# EAGLE design MDM00001 (EAGLE 6.4)

## Sheet 1 of 2
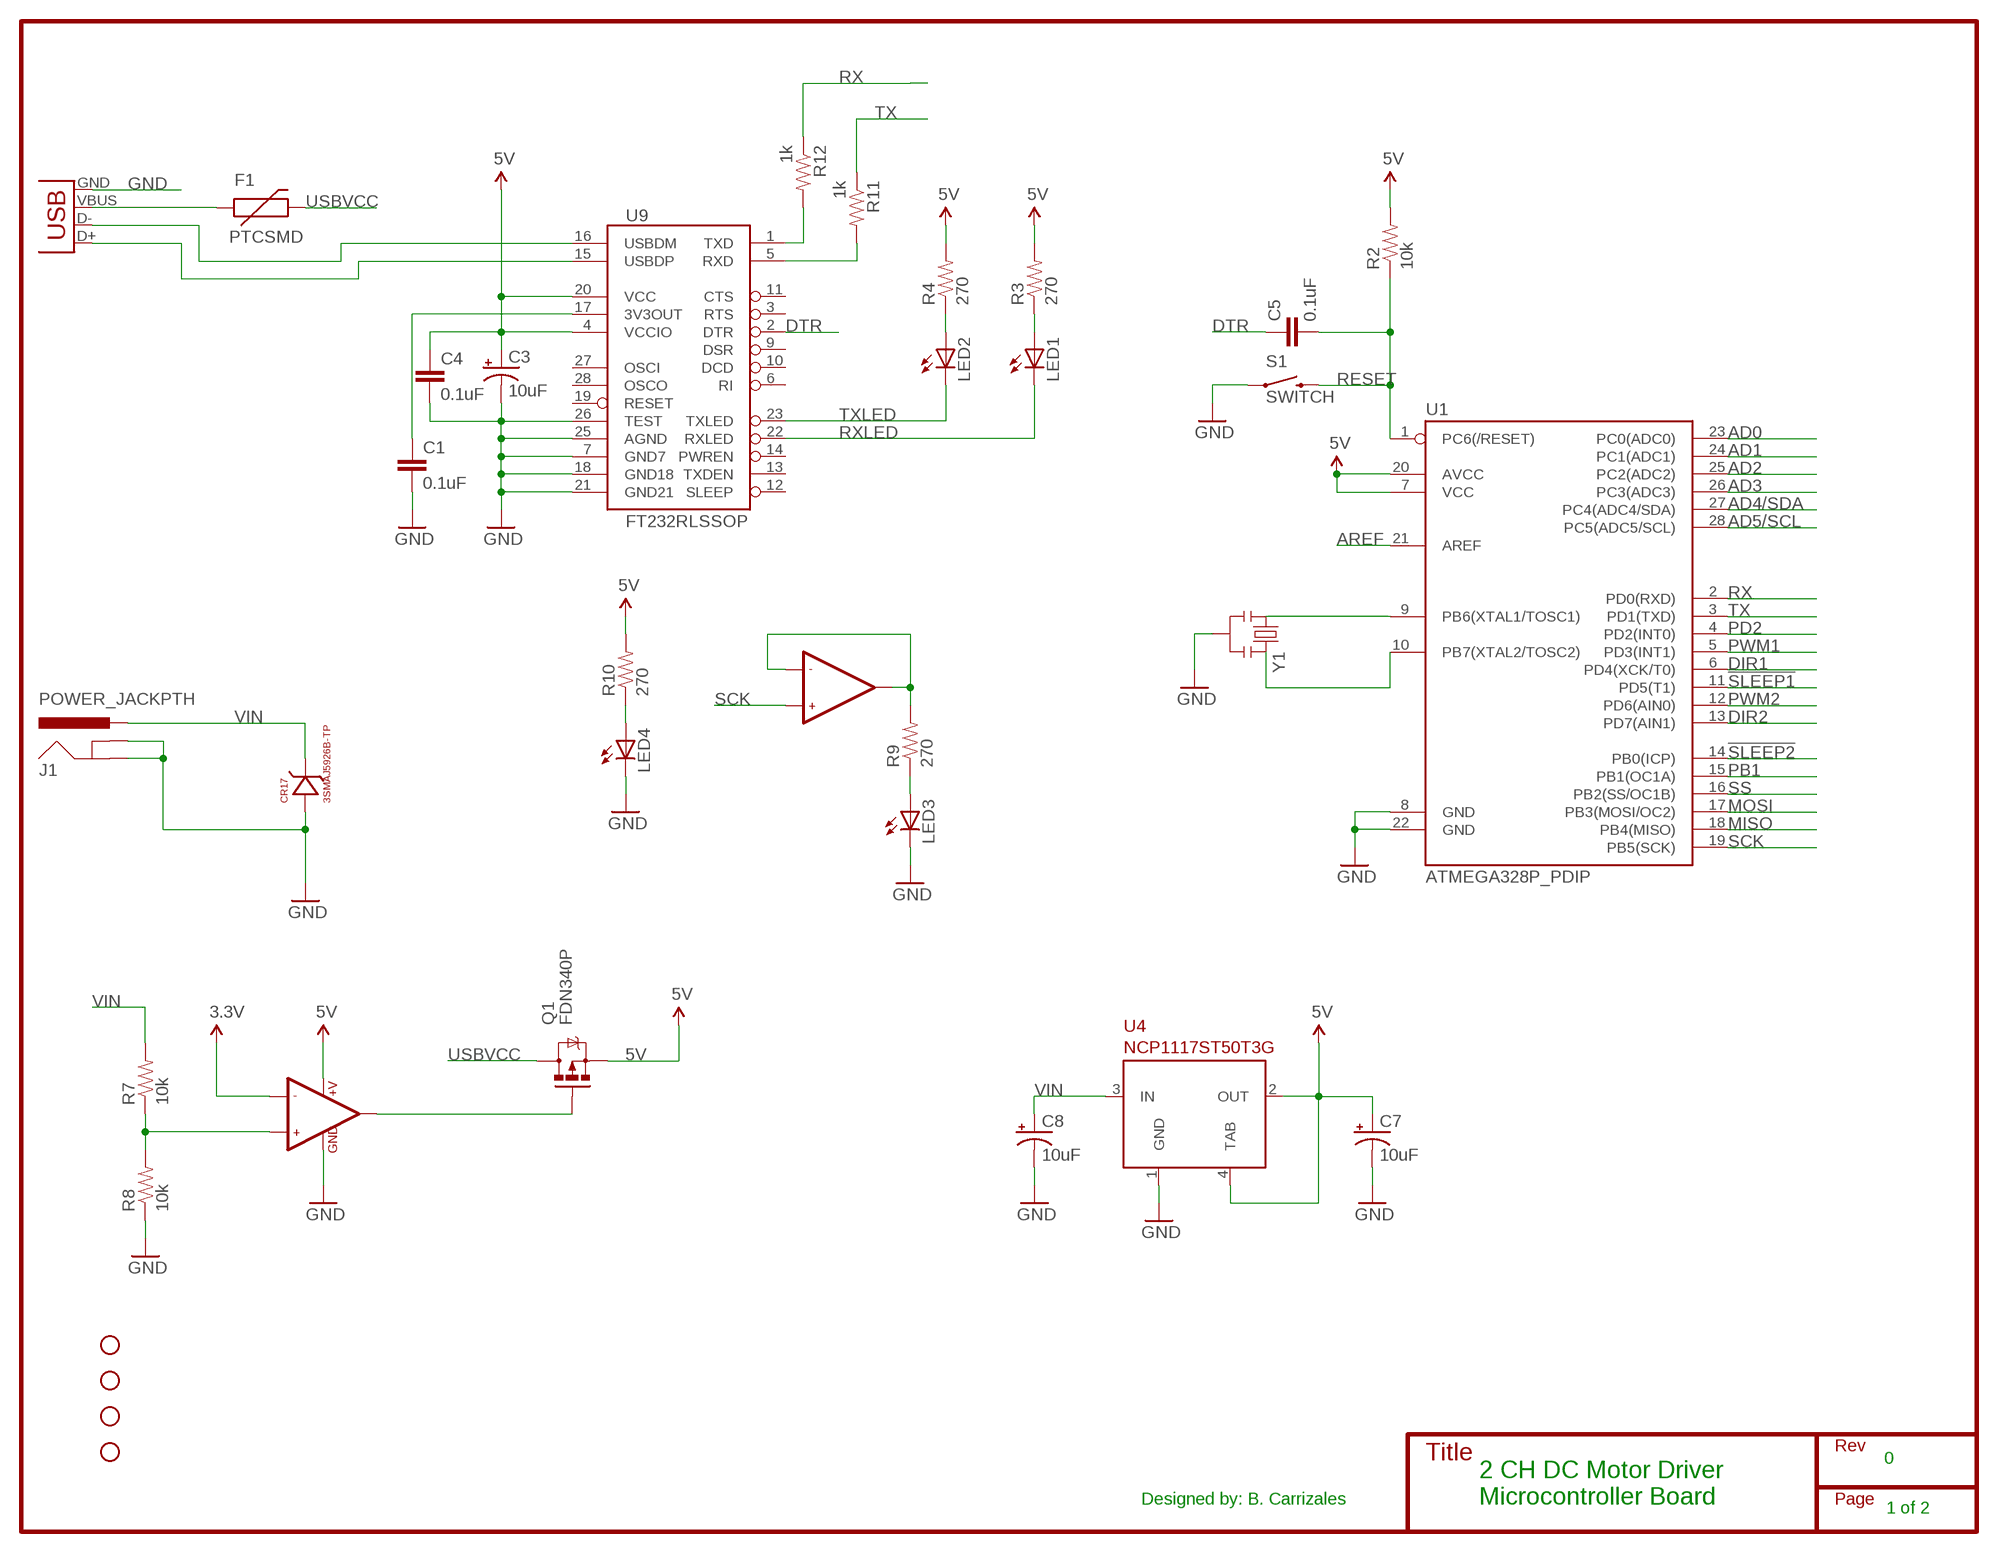
[diagram p0: schematic, sheet 1]

### Parts
C1  0.1uF  CAP0603-CAP  [0603-CAP]
C3  10uF  CAP_POL_AL  [PANASONIC_BMIN]
C4  0.1uF  CAP0603-CAP  [0603-CAP]
C5  0.1uF  CAP0603-CAP  [0603-CAP]
C7  10uF  CAP_POL_AL  [PANASONIC_BMIN]
C8  10uF  CAP_POL_AL  [PANASONIC_BMIN]
CR17  3SMAJ5926B-TP  [DO-214AC]
F1  PTCSMD  [PTC-1206]
J1  POWER_JACKPTH  [POWER_JACK_PTH]
JP2  USBSMD  [USB-MINIB]
LED1  LED0603  [LED-0603]
LED2  LED0603  [LED-0603]
LED3  LED0603  [LED-0603]
LED4  LED0603  [LED-0603]
Q1  FDN340P  MOSFET-PCHANNELSMD  [SOT23-3]
R2  10k  RESISTOR0603-RES  [0603-RES]
R3  270  RESISTOR0603-RES  [0603-RES]
R4  270  RESISTOR0603-RES  [0603-RES]
R7  10k  RESISTOR0603-RES  [0603-RES]
R8  10k  RESISTOR0603-RES  [0603-RES]
R9  270  RESISTOR0603-RES  [0603-RES]
R10  270  RESISTOR0603-RES  [0603-RES]
R11  1k  RESISTOR0603-RES  [0603-RES]
R12  1k  RESISTOR0603-RES  [0603-RES]
S1  SWITCH  SWITCH-MOMENTARY-2PTH  [TACTILE-PTH]
STANDOFF1  STAND-OFF  [STAND-OFF]
STANDOFF2  STAND-OFF  [STAND-OFF]
STANDOFF3  STAND-OFF  [STAND-OFF]
STANDOFF4  STAND-OFF  [STAND-OFF]
U1  ATMEGA328P_PDIP  [DIL28-3]
U4  NCP1117ST50T3G  [SOT223]
U9  FT232RLSSOP  [SSOP28DB]
U$3  LMV358  [SO08]
Y1  RESONATORPTH  [RESONATOR-PTH]

### Nets
3.3V: U$3.2(-IN1)
5V: C3.+ C4.1 C7.+ Q1.2(S) R2.2 R3.2 R4.2 R10.2 U1.7(VCC) U1.20(AVCC) U4.2(OUT) U4.4(TAB) U9.4(VCCIO) U9.20(VCC) U$3.8(+V) ; also sheet 2
!SLEEP1: U1.11(PD5(T1)) ; also sheet 2
!SLEEP2: U1.14(PB0(ICP)) ; also sheet 2
AD0: U1.23(PC0(ADC0)) ; also sheet 2
AD1: U1.24(PC1(ADC1)) ; also sheet 2
AD2: U1.25(PC2(ADC2)) ; also sheet 2
AD3: U1.26(PC3(ADC3))
AD4/SDA: U1.27(PC4(ADC4/SDA))
AD5/SCL: U1.28(PC5(ADC5/SCL))
AREF: U1.21(AREF)
DIR1: U1.6(PD4(XCK/T0)) ; also sheet 2
DIR2: U1.13(PD7(AIN1)) ; also sheet 2
DTR: C5.1 U9.2(DTR)
GND: C1.2 C3.- C4.2 C7.- C8.- CR17.AN J1.GND J1.GNDBREAK JP2.GND LED3.C LED4.C R8.1 S1.1 U1.8(GND) U1.22(GND) U4.1(GND) U9.7(GND7) U9.18(GND18) U9.21(GND21) U9.25(AGND) U9.26(TEST) U$3.4(GND) Y1.2 ; also sheet 2
MISO: U1.18(PB4(MISO)) ; also sheet 2
MOSI: U1.17(PB3(MOSI/OC2)) ; also sheet 2
N$1: U1.9(PB6(XTAL1/TOSC1)) Y1.1
N$2: U1.10(PB7(XTAL2/TOSC2)) Y1.3
N$4: JP2.D- U9.16(USBDM)
N$5: JP2.D+ U9.15(USBDP)
N$6: F1.1 JP2.VBUS
N$7: LED2.A R4.1
N$8: LED1.A R3.1
N$9: R12.2 U9.1(TXD)
N$10: R11.2 U9.5(RXD)
N$12: R7.1 R8.2 U$3.3(+IN1)
N$13: LED3.A R9.1
N$15: R9.2 U$3.6(-IN2) U$3.7(OUT2)
N$17: Q1.1(G) U$3.1(OUT1)
N$19: LED4.A R10.1
N$20: C1.1 U9.17(3V3OUT)
PB1: U1.15(PB1(OC1A))
PD2: U1.4(PD2(INT0))
PWM1: U1.5(PD3(INT1)) ; also sheet 2
PWM2: U1.12(PD6(AIN0)) ; also sheet 2
RESET: C5.2 R2.1 S1.3 U1.1(PC6(/RESET)) ; also sheet 2
RX: R12.1 U1.2(PD0(RXD))
RXLED: LED1.C U9.22(RXLED)
SCK: U1.19(PB5(SCK)) U$3.5(+IN2) ; also sheet 2
SS: U1.16(PB2(SS/OC1B))
TX: R11.1 U1.3(PD1(TXD))
TXLED: LED2.C U9.23(TXLED)
USBVCC: F1.2 Q1.3(D)
VIN: C8.+ CR17.CAT J1.PWR R7.2 U4.3(IN) ; also sheet 2
Unconnected: U9.3(RTS) U9.6(RI) U9.9(DSR) U9.10(DCD) U9.11(CTS) U9.12(SLEEP) U9.13(TXDEN) U9.14(PWREN) U9.19(RESET) U9.27(OSCI) U9.28(OSCO)

### Notes on the sheet
- 0
- Designed by: B. Carrizales
- 2 CH DC Motor Driver
  Microcontroller Board
- 1 of 2

## Sheet 2 of 2
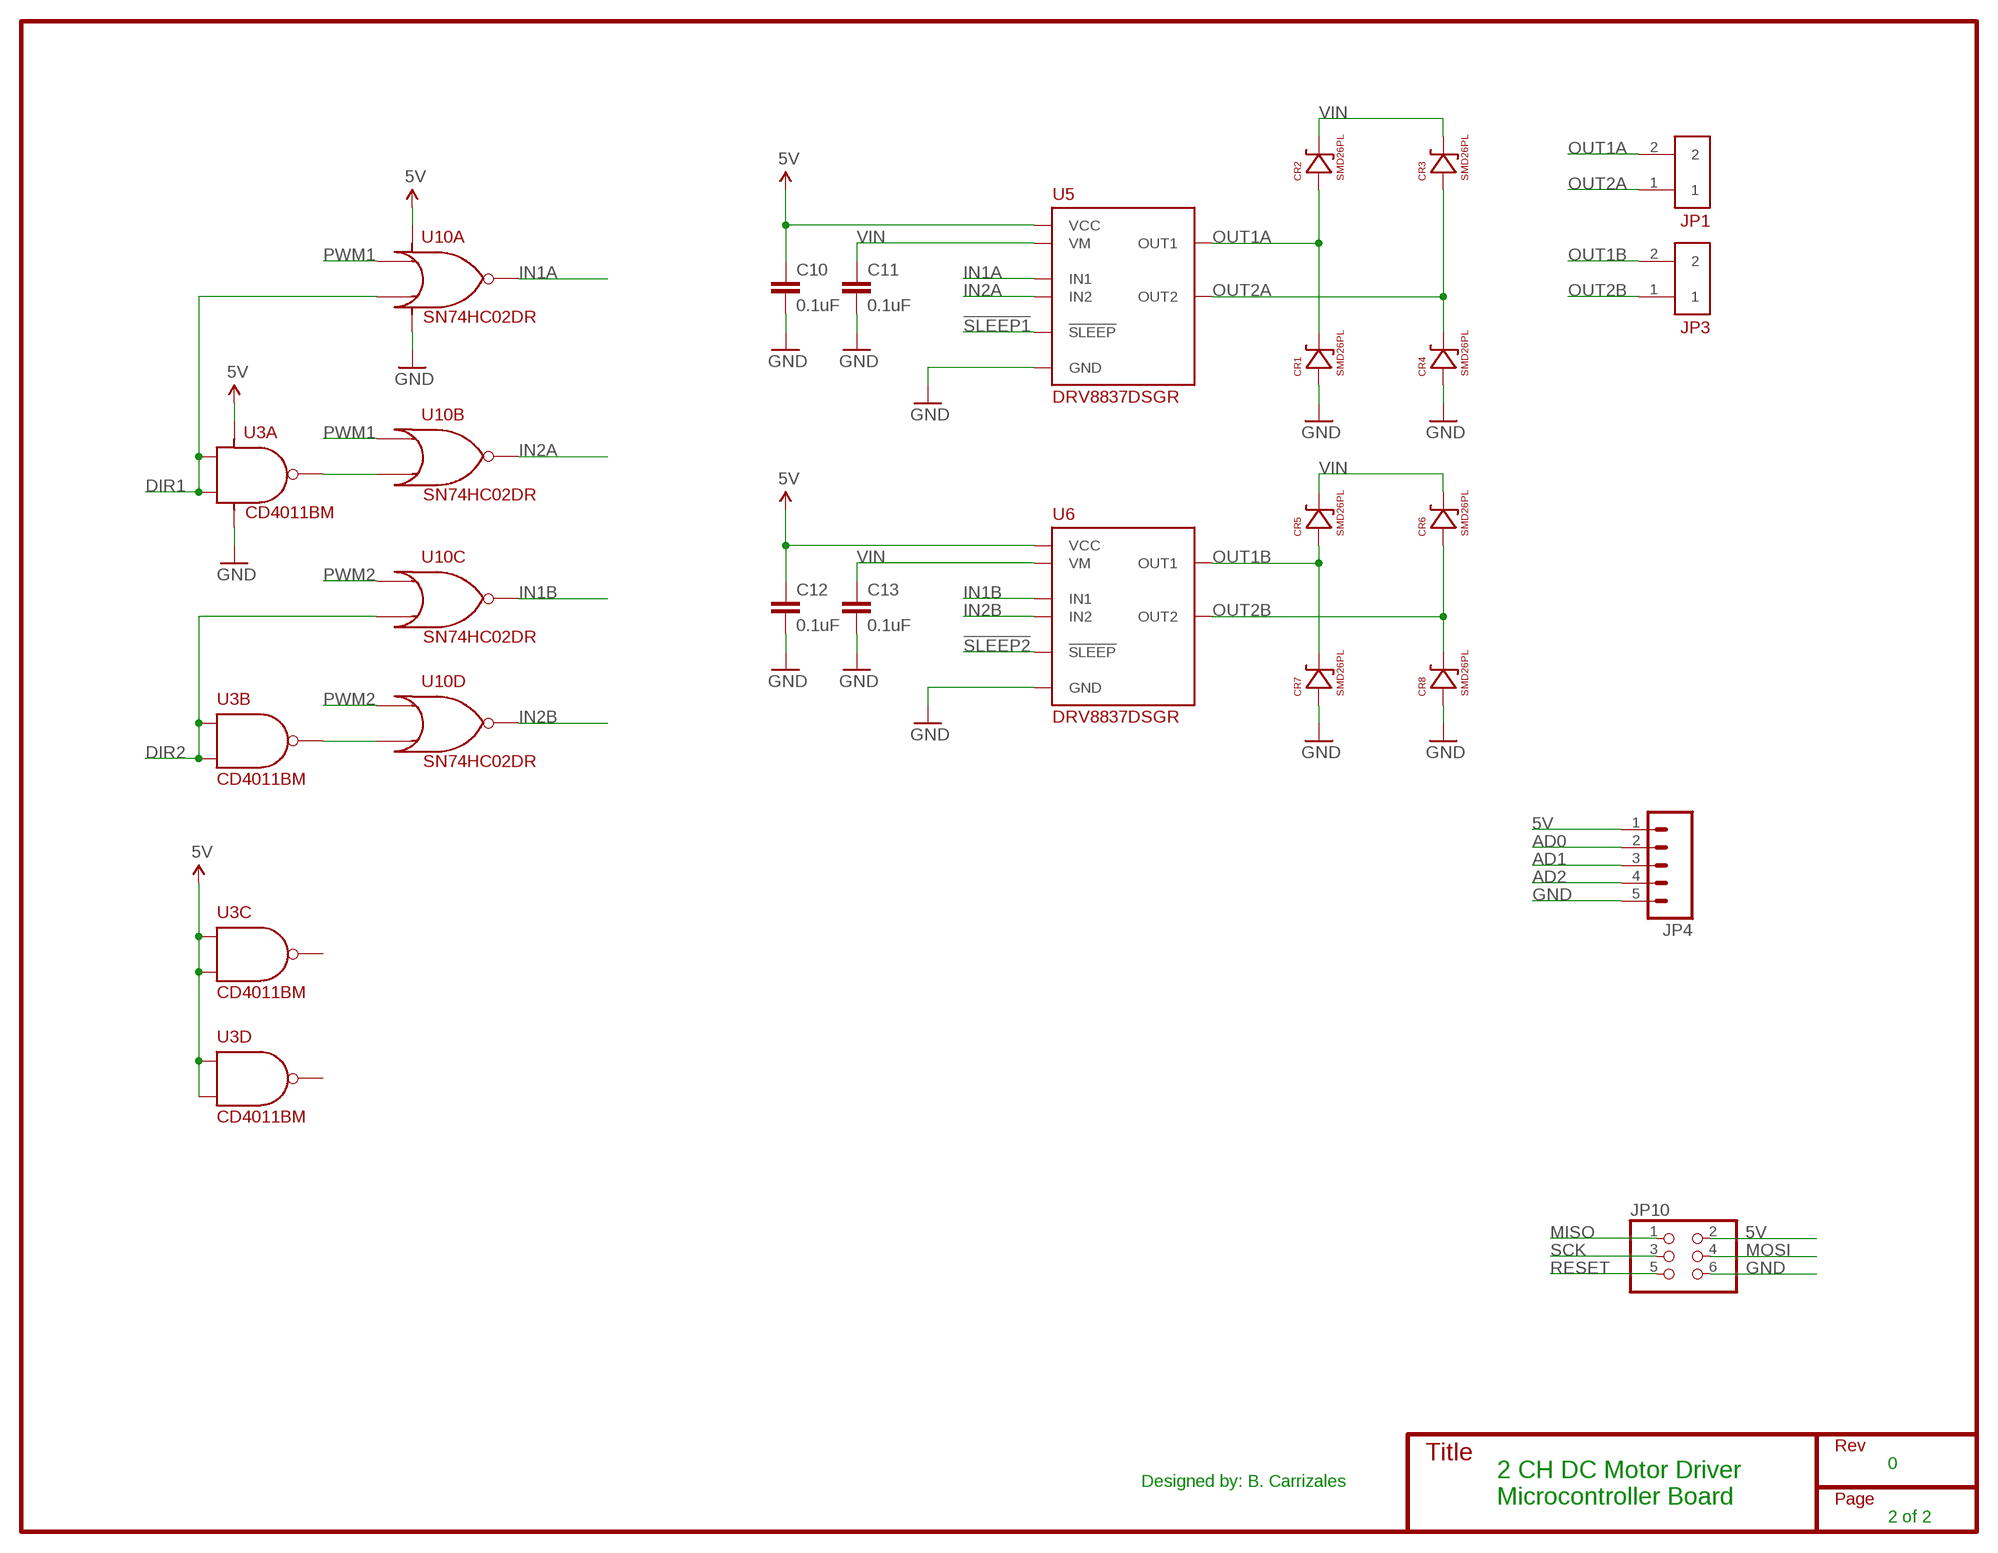
[diagram p1: schematic, sheet 2]

### Parts
C10  0.1uF  CAP0603-CAP  [0603-CAP]
C11  0.1uF  CAP0603-CAP  [0603-CAP]
C12  0.1uF  CAP0603-CAP  [0603-CAP]
C13  0.1uF  CAP0603-CAP  [0603-CAP]
CR1  SMD26PL  [SOD-123FL]
CR2  SMD26PL  [SOD-123FL]
CR3  SMD26PL  [SOD-123FL]
CR4  SMD26PL  [SOD-123FL]
CR5  SMD26PL  [SOD-123FL]
CR6  SMD26PL  [SOD-123FL]
CR7  SMD26PL  [SOD-123FL]
CR8  SMD26PL  [SOD-123FL]
JP1  2-TERMINAL  [OSTTA020161]
JP3  2-TERMINAL  [OSTTA020161]
JP4  M05PTH  [1X05]
JP10  PINHD-2X3  [2X03]
U3  CD4011BM  [14-SOIC]
U5  DRV8837DSGR  [8-WSON]
U6  DRV8837DSGR  [8-WSON]
U10  SN74HC02DR  [14-SOIC]

### Nets
5V: C10.1 C12.1 JP4.1 JP10.2 U3.8(C:I0) U3.9(C:I1) U3.12(D:I0) U3.13(D:I1) U3.14 U5.P$8(VCC) U6.P$8(VCC) U10.14 ; also sheet 1
!SLEEP1: U5.P$7(!SLEEP) ; also sheet 1
!SLEEP2: U6.P$7(!SLEEP) ; also sheet 1
AD0: JP4.2 ; also sheet 1
AD1: JP4.3 ; also sheet 1
AD2: JP4.4 ; also sheet 1
DIR1: U3.1(A:I0) U3.2(A:I1) U10.3(A:I1) ; also sheet 1
DIR2: U3.5(B:I0) U3.6(B:I1) U10.9(C:I1) ; also sheet 1
GND: C10.2 C11.2 C12.2 C13.2 CR1.1 CR4.1 CR7.1 CR8.1 JP4.5 JP10.6 U3.7 U5.P$4(GND) U6.P$4(GND) U10.7 ; also sheet 1
IN1A: U5.P$6(IN1) U10.1(A:O1)
IN1B: U6.P$6(IN1) U10.10(C:O1)
IN2A: U5.P$5(IN2) U10.4(B:O1)
IN2B: U6.P$5(IN2) U10.13(D:O1)
MISO: JP10.1 ; also sheet 1
MOSI: JP10.4 ; also sheet 1
N$3: U3.4(B:O1) U10.12(D:I1)
N$27: U3.3(A:O1) U10.6(B:I1)
OUT1A: CR1.2 CR2.1 JP1.2 U5.P$2(OUT1)
OUT1B: CR5.1 CR7.2 JP3.2 U6.P$2(OUT1)
OUT2A: CR3.1 CR4.2 JP1.1 U5.P$3(OUT2)
OUT2B: CR6.1 CR8.2 JP3.1 U6.P$3(OUT2)
PWM1: U10.2(A:I0) U10.5(B:I0) ; also sheet 1
PWM2: U10.8(C:I0) U10.11(D:I0) ; also sheet 1
RESET: JP10.5 ; also sheet 1
SCK: JP10.3 ; also sheet 1
VIN: C11.1 C13.1 CR2.2 CR3.2 CR5.2 CR6.2 U5.P$1(VM) U6.P$1(VM) ; also sheet 1
Unconnected: U3.10(C:O1) U3.11(D:O1)

### Notes on the sheet
- 0
- Designed by: B. Carrizales
- 2 CH DC Motor Driver
  Microcontroller Board
- 2 of 2

## Library data of the parts
C1 C4 C5 C10-C13 = SparkFun-Passives:CAP: Capacitor Standard 0603 ceramic capacitor, and 0.1" leaded capacitor.
C3 C7 C8 = Passives:CAP_POL_AL: Panasonic Aluminum Electrolytic Capacitor Package B
CR1-CR8 = DiscreteActive:SMD26PL: Schottky Barrier Diode SMD26PL; DIGIKEYPART#: SMD26PL-TPMSCT-ND
CR17 = DiscreteActive:3SMAJ5926B-TP: 3SMAJ5926B-TP, 3W SMD Zener Diode, 11V Regulator; DIGIKEYPART#: 3SMAJ5926B-TPMSCT-ND
F1 = SparkFun-PowerIC:PTC: Resettable Fuse PTC Resettable Fuse. Spark Fun Electronics SKU : COM-08357
J1 = SparkFun-Connectors:POWER_JACK: Power Jack This is the standard 5.5mm barrel jack for power. The PTH is the most common, proven, reliable, footprint. The Slot footprint only works if the mill layer is transmitted to the PCB fab house so be warned. Spark Fun Electronics SKU : PRT-00119 SMT: CONN-08106 Mating wall wart : TOL-00298 (and others)
JP1 JP3 = Connectors:2-TERMINAL: 2-Terminal Header. Based on OSTTA020161; DIGIKEYPART#: ED2561-ND; PART#: OSTTA020161
JP2 = SparkFun-Connectors:USB: USB Connectors USB-B-PTH is fully proven SKU : PRT-00139/CONN-08278 USB-miniB is fully proven SKU : PRT-00587 USB-A-PCB is untested. USB-A-H is throughly reviewed, but untested. Spark Fun Electronics SKU : PRT-00437 USB-B-SMT is throughly reviewed, but untested. Needs silkscreen touching up. USB-A-S has not been used/tested USB-MB-H has not been used/tested USB-MICROB has been used. CONN-09505
JP4 = SparkFun-Connectors:M05: Header 5 Standard 5-pin 0.1" header. Use with straight break away headers (SKU : PRT-00116), right angle break away headers (PRT-00553), swiss pins (PRT-00743), machine pins (PRT-00117), and female headers (PRT-00115). Molex polarized connector foot print use with SKU : PRT-08230 with associated crimp pins and housings.
JP10 = SparkFun-Connectors:PINHD-2X3: PIN HEADER
LED1-LED4 = SparkFun-LED:LED: LEDs Standard schematic elements and footprints for 5mm, 3mm, 1206, and 0603 sized LEDs. 5mm - Spark Fun Electronics SKU : COM-00529 (and others)
Q1 = SparkFun-DiscreteSemi:MOSFET-PCHANNEL: Generic PMOSFET
R2-R4 R7-R12 = SparkFun-Passives:RESISTOR: Resistor Basic schematic elements and footprints for 0603, 1206, and PTH resistors.
S1 = SparkFun-Electromechanical:SWITCH-MOMENTARY-2: Various NO switches- pushbuttons, reed, etc
STANDOFF1-STANDOFF4 = SparkFun-Electromechanical:STAND-OFF: #4 Stand Off This is the mechanical footprint for a #4 phillips button head screw. Use the keepout ring to avoid running the screw head into surrounding components. SKU : PRT-00447
U1 = SparkFun-DigitalIC:ATMEGA328P_PDIP: uC used in the Arduino 32kb flash, 1k EEPROM, 2k SRAM This is the through-hole version of this chip.
U3 = LogicICs:CD4011: CD4011 Quad NAND gate discrete logic IC; DIGIKEYPART#: 296-14474-1-ND
U4 = regulators:NCP1117ST50T3G: NCP1117 5V, 1.0 A Low-Dropout Positive Fixed and Adjustable Voltage Regulator Datasheet <http://www.onsemi.com/pub_link/Collateral/NCP1117-D.PDF>; DIGIKEYPART#: NCP1117ST50T3GOSCT-ND
U5 U6 = PowerICs:DRV8837DSGR: DRV8837DSGR, DC Motor Driver IC see datasheet for more information datasheet <http://www.ti.com/lit/ds/symlink/drv8837.pdf>; DIGIKEYPART#: 296-34806-1-ND
U9 = SparkFun-DigitalIC:FT232RL: USB UART FT232RL 4th Generation USB UART (USB <-> Serial) Controller. Spark Fun Electronics SKU : COM-00650 Production SKU IC-00870; PROD_ID: IC-00870
U10 = LogicICs:SN74HC02DR: SN74HC02DR, Quad, Dual Input Nor Gate; DIGIKEYPART#: 296-1188-1-ND
U$3 = SparkFun-AnalogIC:LMV358: Jellybean rail-to-rail output op-amp; PROD_ID: IC-09657
Y1 = SparkFun-FreqCtrl:RESONATOR: Resonator Small SMD resonator. Used, eg, on the Arduino Pro/ Pro Mini boards. 8MHz- XTAL-08895 16MHz- XTAL-08900

## Board
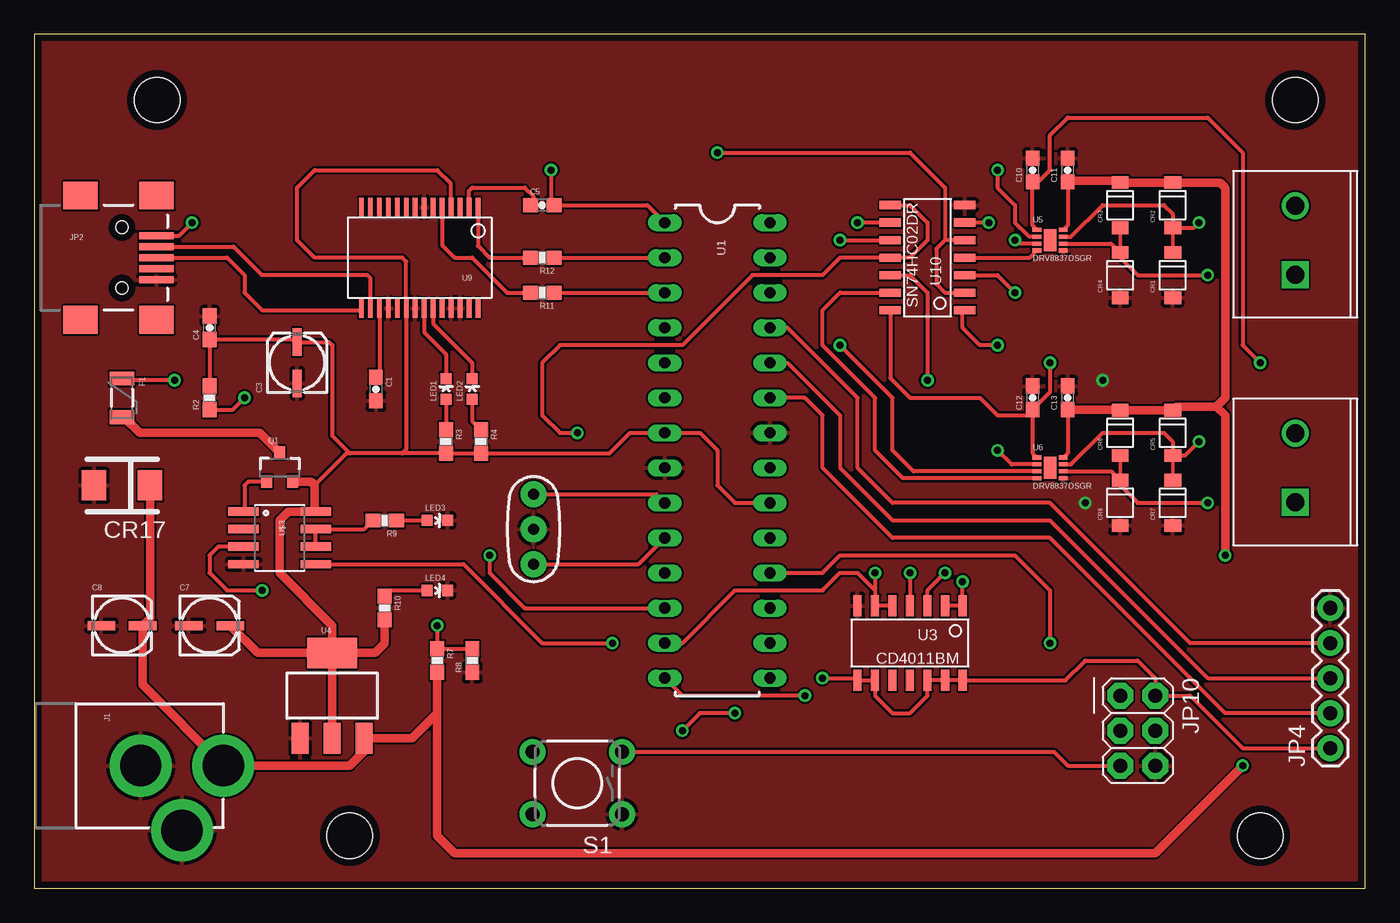
[diagram p2: board, top side]
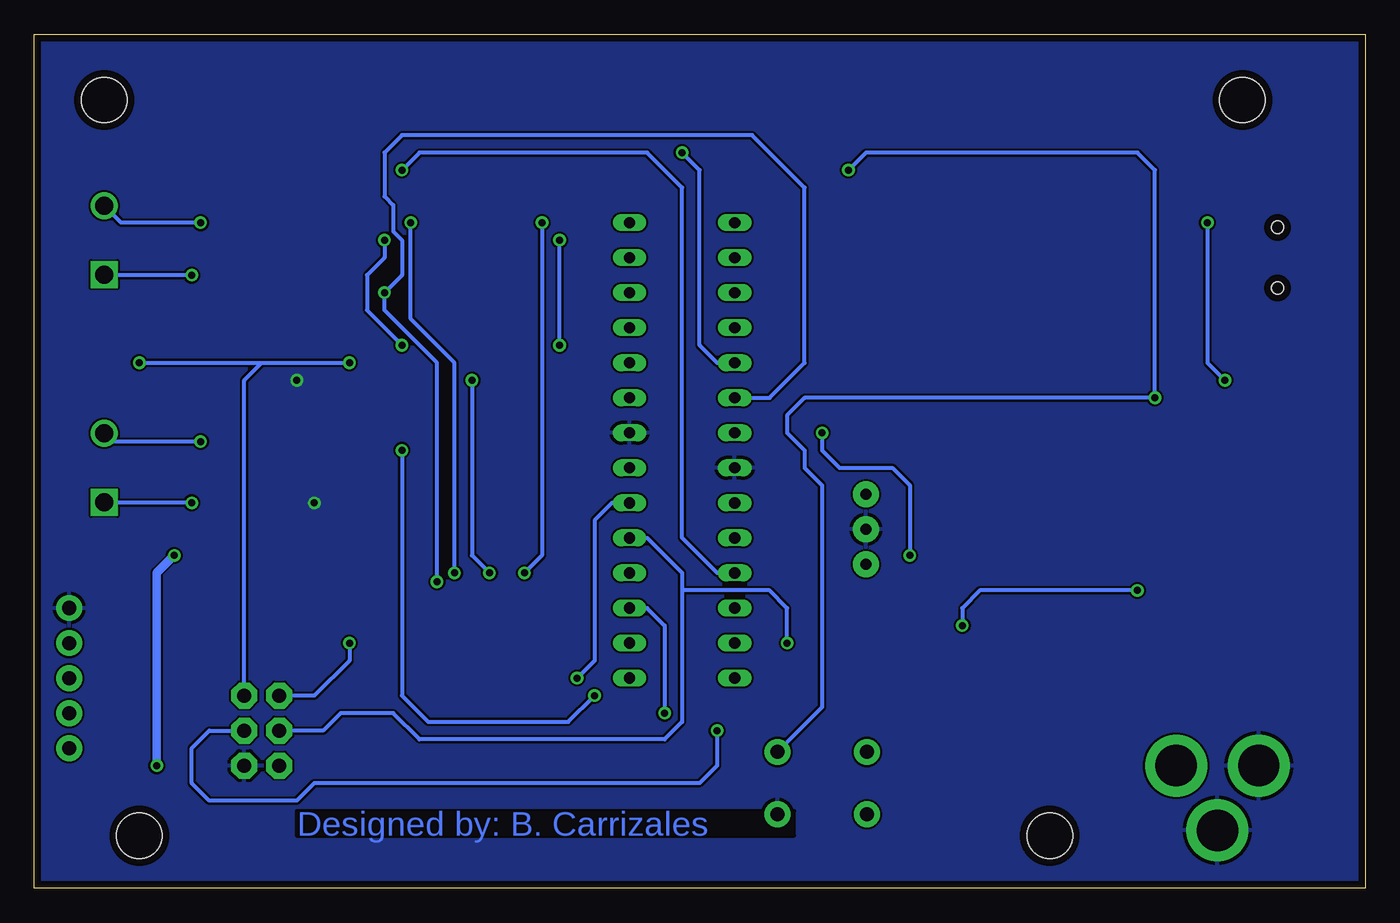
[diagram p3: board, bottom side, seen from below]

Size 96.5 x 61.9 mm. Coordinates in mm from the lower left corner, seen from the top.
Outline: 0,0 96.5,0 96.5,61.9 0,61.9 0,0
Copper layers (1*16): Top 0.0178mm / dielectric 59mil / Bottom 0.0178mm
Design rules "SSC-EAGLE-2Lyr_v1.0.0.3": minimum track width 6mil, minimum drill 14mil, track to track 6mil, track to pad 6mil, pad to pad 6mil, via to via 6mil, smd to smd 6mil, copper to edge 20mil, drill to drill 16mil, minimum pad ring 8mil, minimum via ring 8mil, stop-mask expansion 3mil, vias tented up to drill 0mil, thermal gap 10mil

### Footprints (pad centres in the part's own frame; a part is rotated, then mirrored left to right if it is on the bottom)
0603-CAP = smd 1.1 x 1: 1 -0.85,0; 2 0.85,0
PANASONIC_BMIN = smd 2 x 0.65: + 1.5,0; - -1.5,0
SOD-123FL = smd 0.914 x 1.219: 1 -1.638,0; 2 1.638,0
DO-214AC = smd 1.778 x 2.159: AN 2.032,0; CAT -2.032,0
PTC-1206 = smd 1 x 1.8: 1 -1.4,0; 2 1.4,0
POWER_JACK_PTH = drill 2.997 pad 4.318: GND 0,7.7; GNDBREAK 4.7,10.7; PWR 0,13.7
OSTTA020161 = drill 1.3 square: 1 -2.5,0 | drill 1.3: 2 2.5,0
USB-MINIB = smd 2.5 x 0.5: D+ 2.5,0; D- 2.5,0.8; GND 2.5,-1.6; ID 2.5,-0.8; VBUS 2.5,1.6 | smd 2.5 x 2: MTN1 -3,4.5; MTN2 2.5,4.5; MTN3 -3,-4.5; MTN4 2.5,-4.5 | hole 0.9: 0,2.2; 0,-2.2
1X05 = drill 1.016 pad 1.88: 1 0,0; 2 2.54,0; 3 5.08,0; 4 7.62,0; 5 10.16,0
2X03 = drill 1.016 pad 1.88 octagon: 1 -2.54,-1.27; 2 -2.54,1.27; 3 0,-1.27; 4 0,1.27; 5 2.54,-1.27; 6 2.54,1.27
LED-0603 = smd 0.8 x 0.8: A 0,-0.75; C 0,0.75
SOT23-3 = smd 0.8 x 0.9: 1 -0.95,-1; 2 0.95,-1; 3 0,1.1
0603-RES = smd 1.1 x 1: 1 -0.85,0; 2 0.85,0
TACTILE-PTH = drill 1.016 pad 1.88: 1 -3.251,2.261; 2 3.251,2.261; 3 -3.251,-2.261; 4 3.251,-2.261
STAND-OFF = hole 3.302: 0,0
DIL28-3 = drill 0.813 long: 1 -16.51,-3.81; 2 -13.97,-3.81; 3 -11.43,-3.81; 4 -8.89,-3.81; 5 -6.35,-3.81; 6 -3.81,-3.81; 7 -1.27,-3.81; 8 1.27,-3.81; 9 3.81,-3.81; 10 6.35,-3.81; 11 8.89,-3.81; 12 11.43,-3.81; 13 13.97,-3.81; 14 16.51,-3.81; 15 16.51,3.81; 16 13.97,3.81; 17 11.43,3.81; 18 8.89,3.81; 19 6.35,3.81; 20 3.81,3.81; 21 1.27,3.81; 22 -1.27,3.81; 23 -3.81,3.81; 24 -6.35,3.81; 25 -8.89,3.81; 26 -11.43,3.81; 27 -13.97,3.81; 28 -16.51,3.81
14-SOIC = smd 0.6 x 1.55: 1 -3.81,-2.7; 2 -2.54,-2.7; 3 -1.27,-2.7; 4 0,-2.7; 5 1.27,-2.7; 6 2.54,-2.7; 7 3.81,-2.7; 8 3.81,2.7; 9 2.54,2.7; 10 1.27,2.7; 11 0,2.7; 12 -1.27,2.7; 13 -2.54,2.7; 14 -3.81,2.7
SOT223 = smd 1.219 x 2.235: 1 -2.311,-3.099; 2 0,-3.099; 3 2.311,-3.099 | smd 3.6 x 2.2: 4 0,3.099
8-WSON = smd 0.3 x 0.64: P$1 -0.75,0.95; P$2 -0.25,0.95; P$3 0.25,0.95; P$4 0.75,0.95; P$5 0.75,-0.95; P$6 0.25,-0.95; P$7 -0.25,-0.95; P$8 -0.75,-0.95 | smd 1.6 x 0.9: P$9 0,0
SSOP28DB = smd 0.348 x 1.397: 1 -4.225,-3.656; 2 -3.575,-3.656; 3 -2.925,-3.656; 4 -2.275,-3.656; 5 -1.625,-3.656; 6 -0.975,-3.656; 7 -0.325,-3.656; 8 0.325,-3.656; 9 0.975,-3.656; 10 1.625,-3.656; 11 2.275,-3.656; 12 2.925,-3.656; 13 3.575,-3.656; 14 4.225,-3.656; 15 4.225,3.656; 16 3.575,3.656; 17 2.925,3.656; 18 2.275,3.656; 19 1.625,3.656; 20 0.975,3.656; 21 0.325,3.656; 22 -0.325,3.656; 23 -0.975,3.656; 24 -1.625,3.656; 25 -2.275,3.656; 26 -2.925,3.656; 27 -3.575,3.656; 28 -4.225,3.656
SO08 = smd 0.61 x 2.21: 1 -1.905,-2.616; 2 -0.635,-2.616; 3 0.635,-2.616; 4 1.905,-2.616; 5 1.905,2.616; 6 0.635,2.616; 7 -0.635,2.616; 8 -1.905,2.616
RESONATOR-PTH = drill 0.8 pad 1.88: 1 -2.54,0; 2 0,0; 3 2.54,0

### Placement (x,y rotation side)
C1  24.77,36.2 270 top
C3  19.05,38.1 90 top
C4  12.7,40.64 90 top
C5  36.83,49.53 0 top
C7  12.7,19.05 0 top
C8  6.35,19.05 0 top
C10  72.39,52.07 90 top
C11  74.93,52.07 90 top
C12  72.39,35.56 90 top
C13  74.93,35.56 90 top
CR1  82.55,44.45 90 top
CR2  82.55,49.53 90 top
CR3  78.74,49.53 90 top
CR4  78.74,44.45 90 top
CR5  82.55,33.02 90 top
CR6  78.74,33.02 90 top
CR7  82.55,27.94 90 top
CR8  78.74,27.94 90 top
CR17  6.35,29.21 180 top
F1  6.35,35.56 270 top
J1  0,8.89 270 top
JP1  91.44,46.99 90 top
JP2  6.35,45.72 0 top
JP3  91.44,30.48 90 top
JP4  93.98,10.16 90 top
JP10  80.01,11.43 270 top
LED1  29.84,36.2 0 top
LED2  31.75,36.2 0 top
LED3  29.21,26.67 270 top
LED4  29.21,21.59 270 top
Q1  17.78,30.48 0 top
R2  12.7,35.56 90 top
R3  29.84,32.38 270 top
R4  32.38,32.38 270 top
R7  29.21,16.51 270 top
R8  31.75,16.51 90 top
R9  25.4,26.67 180 top
R10  25.4,20.32 270 top
R11  36.83,43.18 180 top
R12  36.83,45.72 180 top
S1  39.37,7.62 180 top
STANDOFF1  91.44,57.15 0 top
STANDOFF2  22.86,3.81 0 top
STANDOFF3  8.89,57.15 0 top
STANDOFF4  88.9,3.81 0 top
U1  49.53,31.75 270 top
U3  63.5,17.78 180 top
U4  21.59,13.97 0 top
U5  73.66,46.99 270 top
U6  73.66,30.48 270 top
U9  27.94,45.72 180 top
U10  64.77,45.72 90 top
U$3  17.78,25.4 270 top
Y1  36.2,26.04 270 top

### Tracks (layer width: path | path; a pad name or v marks a point on that pad's centre or on a via)
5V  (via drill 0.51)
  Top 0.305: C10.1 72.39,50.8 | U5.P$8 72.39,48.06 72.39,50.8 | C12.1 72.39,31.55 U6.P$8 | U9.4 30.21,51.06 29.21,52.07 20.32,52.07 19.05,50.8 19.05,46.99 20.32,45.72 26.67,45.72 26.96,45.42 U9.20 26.96,31.83 26.67,31.54 | R2.2 C4.1 18.86,39.79 C3.+ 21.36,39.6 21.59,39.37 21.59,32.8 22.86,31.54 | 26.67,31.54 R3.2 R4.2 41.7,31.54 43.18,33.02 U1.7 48.26,33.02 49.53,31.75 49.53,29.21 50.8,27.94 U1.20 | 26.67,31.54 22.86,31.54 | 22.86,31.54 22.64,31.54 20.32,29.21 | JP4.1 87.63,10.16 83.82,13.97 JP10.2 81.28,15.24 80.01,16.51 76.2,16.51 74.77,15.08 U3.14 U3.13 U3.12 64.77,13.97 63.5,12.7 62.23,12.7 60.96,13.97 U3.9 U3.8 59.53,15.24 v57.15,15.24 | 72.39,50.8 73.66,52.07 73.66,54.61 74.93,55.88 85.09,55.88 87.63,53.34 87.63,39.37 v88.9,38.1 | v73.66,38.1 73.66,35.98 C12.1 | U10.14 62.07,36.99 63.5,35.56 68.58,35.56 69.85,34.29 71.97,34.29 C12.1
  Top 0.61: U4.2 U4.4 | U4.4 16.18,17.07 C7.+ | U4.4 24.69,17.07 25.4,17.78 R10.2 | Q1.2 20.05,29.48 20.32,29.21 20.32,27.38 U$3.8 18.41,27.3 17.78,26.67 17.78,22.86 21.59,19.05 U4.4
  Bottom 0.305: U1.20 54.61,27.94 55.88,26.67 55.88,16.51 v57.15,15.24 | v88.9,38.1 80.01,38.1 | 80.01,38.1 v73.66,38.1 | JP10.2 81.28,36.83 80.01,38.1
!SLEEP1  (via drill 0.51)
  Top 0.305: v69.85,52.07 69.85,50.8 71.12,49.53 71.12,48.26 72.14,47.24 U5.P$7
  Bottom 0.305: U1.11 46.99,22.86 49.53,25.4 49.53,50.8 52.07,53.34 68.58,53.34 v69.85,52.07
!SLEEP2  (via drill 0.51)
  Top 0.305: U6.P$7 70.87,30.73 v69.85,31.75 | v55.88,13.97 46.99,13.97 U1.14
  Bottom 0.305: v69.85,31.75 69.85,13.97 67.94,12.06 57.78,12.06 v55.88,13.97
AD0
  Top 0.305: JP4.2 86.36,12.7 73.66,25.4 62.23,25.4 57.15,30.48 57.15,34.29 55.88,35.56 U1.23
AD1
  Top 0.305: U1.24 54.61,38.1 58.42,34.29 58.42,30.48 62.23,26.67 73.66,26.67 85.09,15.24 JP4.3
AD2
  Top 0.305: JP4.4 83.82,17.78 73.66,27.94 62.23,27.94 59.69,30.48 59.69,35.56 54.61,40.64 U1.25
DIR1  (via drill 0.51)
  Top 0.305: U3.2 U3.1 v67.31,22.23 | U10.3 69.85,44.45 v71.12,43.18
  Bottom 0.305: v67.31,22.23 67.31,38.1 71.12,41.91 v71.12,43.18 69.85,44.45 69.85,46.99 70.48,47.62 70.48,49.53 71.12,50.16 71.12,53.34 69.85,54.61 44.45,54.61 40.64,50.8 40.64,38.1 43.18,35.56 U1.6
DIR2  (via drill 0.51)
  Top 0.305: U3.5 U3.6 60.96,21.59 | U1.13 46.99,17.78 50.8,21.59 57.15,21.59 58.42,22.86 59.69,22.86 60.96,21.59 | U10.9 v59.69,48.26 | v60.96,22.86 60.96,21.59
  Bottom 0.305: v59.69,48.26 59.69,24.13 v60.96,22.86
DTR
  Top 0.305: U9.2 31.52,50.56 31.75,50.8 35.56,50.8 36.2,50.16 36.2,49.74 C5.1
GND  (via drill 0.51)
  other vias: 77.47,36.83 76.2,27.94
  pour Top: 0,62.23 0,0 96.52,0 96.52,62.23
  pour Bottom: 0,62.23 0,0 96.52,0 96.52,62.23
IN1A  (via drill 0.51)
  Top 0.305: U5.P$6 71.37,46.74 v71.12,46.99 | v69.85,39.37 68.58,39.37 67.31,40.64 67.31,41.75 U10.1
  Bottom 0.305: v71.12,46.99 71.12,45.72 72.39,44.45 72.39,41.91 v69.85,39.37
IN1B  (via drill 0.51)
  Top 0.305: U6.P$6 63.75,30.23 62.23,31.75 62.23,35.56 v58.42,39.37 | v58.42,46.99 U10.10
  Bottom 0.305: v58.42,39.37 v58.42,46.99
IN2A
  Top 0.305: U10.4 72.19,45.72 U5.P$5
IN2B
  Top 0.305: U6.P$5 62.98,29.73 60.96,31.75 60.96,35.56 57.15,39.37 57.15,41.91 58.42,43.18 U10.13
MISO  (via drill 0.51)
  Top 0.305: U1.18 57.15,22.86 58.42,24.13 71.12,24.13 73.66,21.59 v73.66,17.78
  Bottom 0.305: v73.66,17.78 73.66,16.51 76.2,13.97 JP10.1
MOSI  (via drill 0.51)
  Top 0.305: v50.8,12.7 48.26,12.7 v46.99,11.43
  Bottom 0.305: U1.17 52.07,20.32 50.8,19.05 v50.8,12.7 | v46.99,11.43 46.99,8.89 48.26,7.62 76.2,7.62 77.47,6.35 83.82,6.35 85.09,7.62 85.09,10.16 83.82,11.43 JP10.4
N$1
  Top 0.305: Y1.1 45.09,28.57 U1.9
N$2
  Top 0.305: Y1.3 43.81,23.5 U1.10
N$3  (via drill 0.51)
  Top 0.305: U10.12 63.5,44.45 64.77,43.18 v64.77,36.83 | v63.5,22.86 U3.4
  Bottom 0.305: v64.77,36.83 64.77,24.13 v63.5,22.86
N$4
  Top 0.305: JP2.D- 14.44,46.52 16.51,44.45 24.13,44.45 24.36,44.22 U9.16
N$5
  Top 0.305: JP2.D+ 13.97,45.72 15.24,44.45 15.24,43.18 16.51,41.91 23.56,41.91 U9.15
N$6  (via drill 0.51)
  Top 0.305: JP2.VBUS 10.49,47.32 v11.43,48.26 | v10.16,36.83 6.48,36.83 F1.1
  Bottom 0.305: v11.43,48.26 11.43,38.1 v10.16,36.83
N$7
  Top 0.305: LED2.A 31.75,33.87 R4.1
N$8
  Top 0.305: LED1.A R3.1
N$9
  Top 0.305: U9.1 32.16,46.58 33.02,45.72 R12.2
N$10
  Top 0.305: U9.5 29.57,46.63 30.48,45.72 31.75,45.72 34.29,43.18 R11.2
N$12  (via drill 0.51)
  Top 0.305: R8.2 R7.1 v29.21,19.05 | U$3.3 13.34,24.77 12.7,24.13 12.7,22.86 13.97,21.59 v16.51,21.59
  Bottom 0.305: v16.51,21.59 27.94,21.59 29.21,20.32 v29.21,19.05
N$13
  Top 0.305: R9.1 LED3.A
N$15
  Top 0.305: U$3.6 U$3.7 23.91,26.04 R9.2
N$17
  Top 0.305: Q1.1 15.51,29.48 15.24,29.21 15.24,27.38 U$3.1
N$19
  Top 0.305: R10.1 25.82,21.59 LED4.A
N$20
  Top 0.305: U9.17 25.02,37.3 C1.1
N$27  (via drill 0.51)
  Top 0.305: U3.3 64.77,21.59 v66.04,22.86 | v69.22,48.26 U10.6
  Bottom 0.305: v66.04,22.86 66.04,38.1 69.22,41.27 v69.22,48.26
OUT1A  (via drill 0.51)
  Top 0.254: CR2.1 CR1.2
  Top 0.305: U5.P$2 75.18,47.24 77.47,49.53 81.92,49.53 82.55,48.9 CR2.1 84.09,47.89 v84.45,48.26
  Bottom 0.305: v84.45,48.26 90.21,48.26 JP1.2
OUT1B  (via drill 0.51)
  Top 0.254: CR5.1 CR7.2
  Top 0.305: U6.P$2 75.18,30.73 77.47,33.02 81.92,33.02 82.55,32.38 CR5.1 83.45,31.38 v84.45,32.38
  Bottom 0.305: v84.45,32.38 90.84,32.38 JP3.2
OUT2A  (via drill 0.51)
  Top 0.254: CR3.1 CR4.2
  Top 0.305: U5.P$3 78.09,46.74 CR4.2 78.74,45.72 80.01,44.45 v85.09,44.45
  Bottom 0.305: v85.09,44.45 91.4,44.45 JP1.1
OUT2B  (via drill 0.51)
  Top 0.254: CR6.1 CR8.2
  Top 0.305: U6.P$3 78.09,30.23 CR8.2 78.74,29.21 80.01,27.94 v85.09,27.94
  Bottom 0.305: v85.09,27.94 91.4,27.94 JP3.1
PWM1  (via drill 0.51)
  Top 0.305: v49.53,53.34 63.5,53.34 66.04,50.8 66.04,46.99 | 67.31,46.99 U10.5 66.04,46.99 | 66.04,46.99 65.41,46.35 65.41,43.81 66.04,43.18 U10.2
  Bottom 0.305: U1.5 46.99,38.1 48.26,39.37 48.26,52.07 v49.53,53.34
PWM2  (via drill 0.51)
  Top 0.305: U10.8 63.5,49.53 64.77,48.26 64.77,46.99 63.5,45.72 U10.11 58.42,45.72 57.15,44.45 52.07,44.45 46.99,39.37 38.1,39.37 36.83,38.1 36.83,34.29 38.1,33.02 v39.37,33.02 | v33.02,24.13 33.02,22.86 35.56,20.32 U1.12
  Bottom 0.305: v39.37,33.02 39.37,31.75 38.1,30.48 34.29,30.48 33.02,29.21 v33.02,24.13
RESET  (via drill 0.51)
  Top 0.305: R2.1 14.39,34.71 v15.24,35.56 | v37.47,52.07 37.47,49.74 C5.2 44.45,49.53 U1.1 | S1.3 73.94,9.88 74.93,8.89 JP10.5
  Bottom 0.305: v37.47,52.07 36.2,53.34 16.51,53.34 15.24,52.07 v15.24,35.56 40.64,35.56 41.91,34.29 41.91,33.02 40.64,31.75 40.64,30.48 39.37,29.21 39.37,13.13 41.91,10.59 42.13,10.38 S1.3
RX
  Top 0.305: R12.1 U1.2
RXLED
  Top 0.305: U9.22 28.27,40.31 29.84,38.73 LED1.C
SCK  (via drill 0.51)
  Top 0.305: U$3.5 31.11,23.5 36.83,17.78 v41.91,17.78
  Bottom 0.305: U1.19 52.07,25.4 49.53,22.86 49.53,21.59 | 49.53,21.59 49.53,12.06 50.8,10.79 68.58,10.79 70.48,12.7 74.3,12.7 75.56,11.43 JP10.3 | v41.91,17.78 41.91,20.32 43.18,21.59 49.53,21.59
TX
  Top 0.305: R11.1 U1.3
TXLED
  Top 0.305: U9.23 28.91,40.94 31.75,38.1 LED2.C
USBVCC
  Top 0.61: F1.2 6.48,34.16 7.62,33.02 16.34,33.02 Q1.3
VIN  (via drill 0.51)
  Top 0.254: 74.93,51.31 C11.1
  Top 0.305: 78.6,51.31 CR3.2 | 78.69,34.71 CR6.2 | C13.1 74.93,31.55 U6.P$1 | C11.1 74.93,48.06 U5.P$1
  Top 0.61: CR17.CAT 8.38,19.58 C8.+ 7.85,14.74 J1.PWR 22.86,8.89 24.13,10.16 24.13,10.64 U4.3 27.38,10.87 29.21,12.7 R7.2 29.21,3.81 30.48,2.54 81.28,2.54 v87.63,8.89 | v86.36,24.13 86.36,34.29 85.72,34.92 | 85.72,34.92 82.82,34.92 CR5.2 CR6.2 | 85.72,34.92 86.36,35.56 86.36,50.8 85.99,51.17 CR2.2 CR3.2 | 78.6,51.31 75.02,51.31 C11.1 | 78.69,34.71 C13.1
  Bottom 0.61: v87.63,8.89 87.63,22.86 v86.36,24.13

### Text on the board
Bottom: Designed by: B. Carrizales